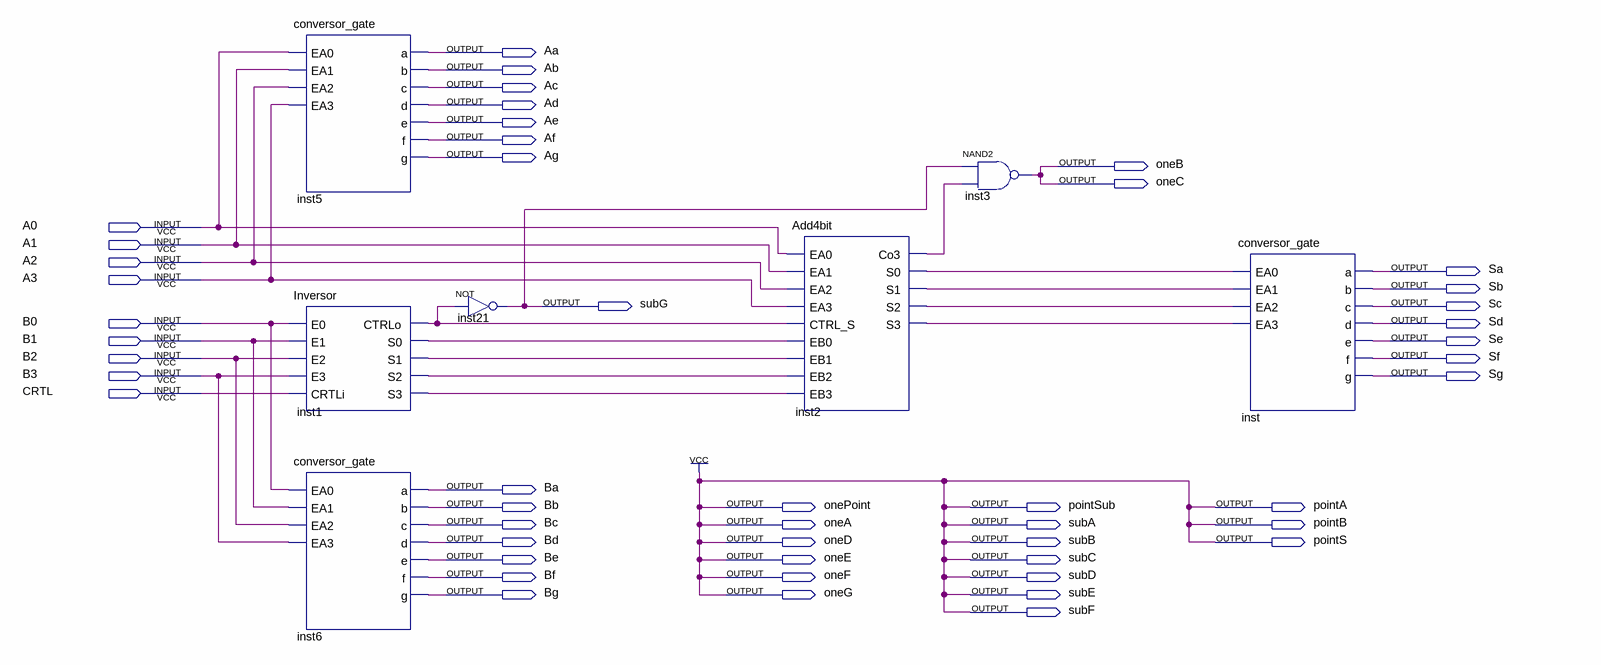
[diagram p0: schematic sheet]
// Quartus schematic FullAdder.bdf as structural Verilog: 7 symbols, 49 pins
module FullAdder (
  input  A0,
  input  A1,
  input  A2,
  input  A3,
  input  B0,
  input  B1,
  input  B2,
  input  B3,
  input  CRTL,
  output Aa,
  output Ab,
  output Ac,
  output Ad,
  output Ae,
  output Af,
  output Ag,
  output oneB,
  output oneC,
  output Sa,
  output Sb,
  output subG,
  output Sc,
  output Sd,
  output Se,
  output Sf,
  output Sg,
  output Ba,
  output Bb,
  output onePoint,
  output pointSub,
  output pointA,
  output Bc,
  output oneA,
  output subA,
  output pointB,
  output Bd,
  output oneD,
  output subB,
  output pointS,
  output Be,
  output oneE,
  output subC,
  output Bf,
  output oneF,
  output subD,
  output Bg,
  output oneG,
  output subE,
  output subF
);

  wire inst1_ctrlo, inst1_s0, inst1_s1, inst1_s2, inst1_s3, inst2_co3, inst2_s0, inst2_s1, inst2_s2, inst2_s3;

  conversor_gate inst5 (.EA0(A0), .EA1(A1), .EA2(A2), .EA3(A3), .a(Aa), .b(Ab), .c(Ac), .d(Ad), .e(Ae), .f(Af), .g(Ag));
  Inversor inst1 (
    .E0(B0), .E1(B1), .E2(B2), .E3(B3), .CRTLi(CRTL), .CTRLo(inst1_ctrlo), .S0(inst1_s0), .S1(inst1_s1),
    .S2(inst1_s2), .S3(inst1_s3));
  conversor_gate inst6 (.EA0(B0), .EA1(B1), .EA2(B2), .EA3(B3), .a(Ba), .b(Bb), .c(Bc), .d(Bd), .e(Be), .f(Bf), .g(Bg));
  not inst21 (subG, inst1_ctrlo);
  Add4bit inst2 (
    .EA0(A0), .EA1(A1), .EA2(A2), .EA3(A3), .CTRL_S(inst1_ctrlo), .EB0(inst1_s0), .EB1(inst1_s1),
    .EB2(inst1_s2), .EB3(inst1_s3), .Co3(inst2_co3), .S0(inst2_s0), .S1(inst2_s1), .S2(inst2_s2),
    .S3(inst2_s3));
  nand inst3 (oneB, subG, inst2_co3);
  conversor_gate inst (
    .EA0(inst2_s0), .EA1(inst2_s1), .EA2(inst2_s2), .EA3(inst2_s3), .a(Sa), .b(Sb), .c(Sc), .d(Sd), .e(Se),
    .f(Sf), .g(Sg));

  assign oneA = 1'b1;
  assign oneC = oneB;
  assign oneD = 1'b1;
  assign oneE = 1'b1;
  assign oneF = 1'b1;
  assign oneG = 1'b1;
  assign onePoint = 1'b1;
  assign pointA = 1'b1;
  assign pointB = 1'b1;
  assign pointS = 1'b1;
  assign pointSub = 1'b1;
  assign subA = 1'b1;
  assign subB = 1'b1;
  assign subC = 1'b1;
  assign subD = 1'b1;
  assign subE = 1'b1;
  assign subF = 1'b1;
endmodule
